# EasyEDA schematic SCH_Final-2_2024-12-22.json
TITLE: SKEMATIK ARDUINO UNO R3; REV: 1.0; Date: 2024-10-28; Sheet: 1/1; Drawn By: FAJAR RICHARDO; Company: UNIVERSITAS PADJADJARAN
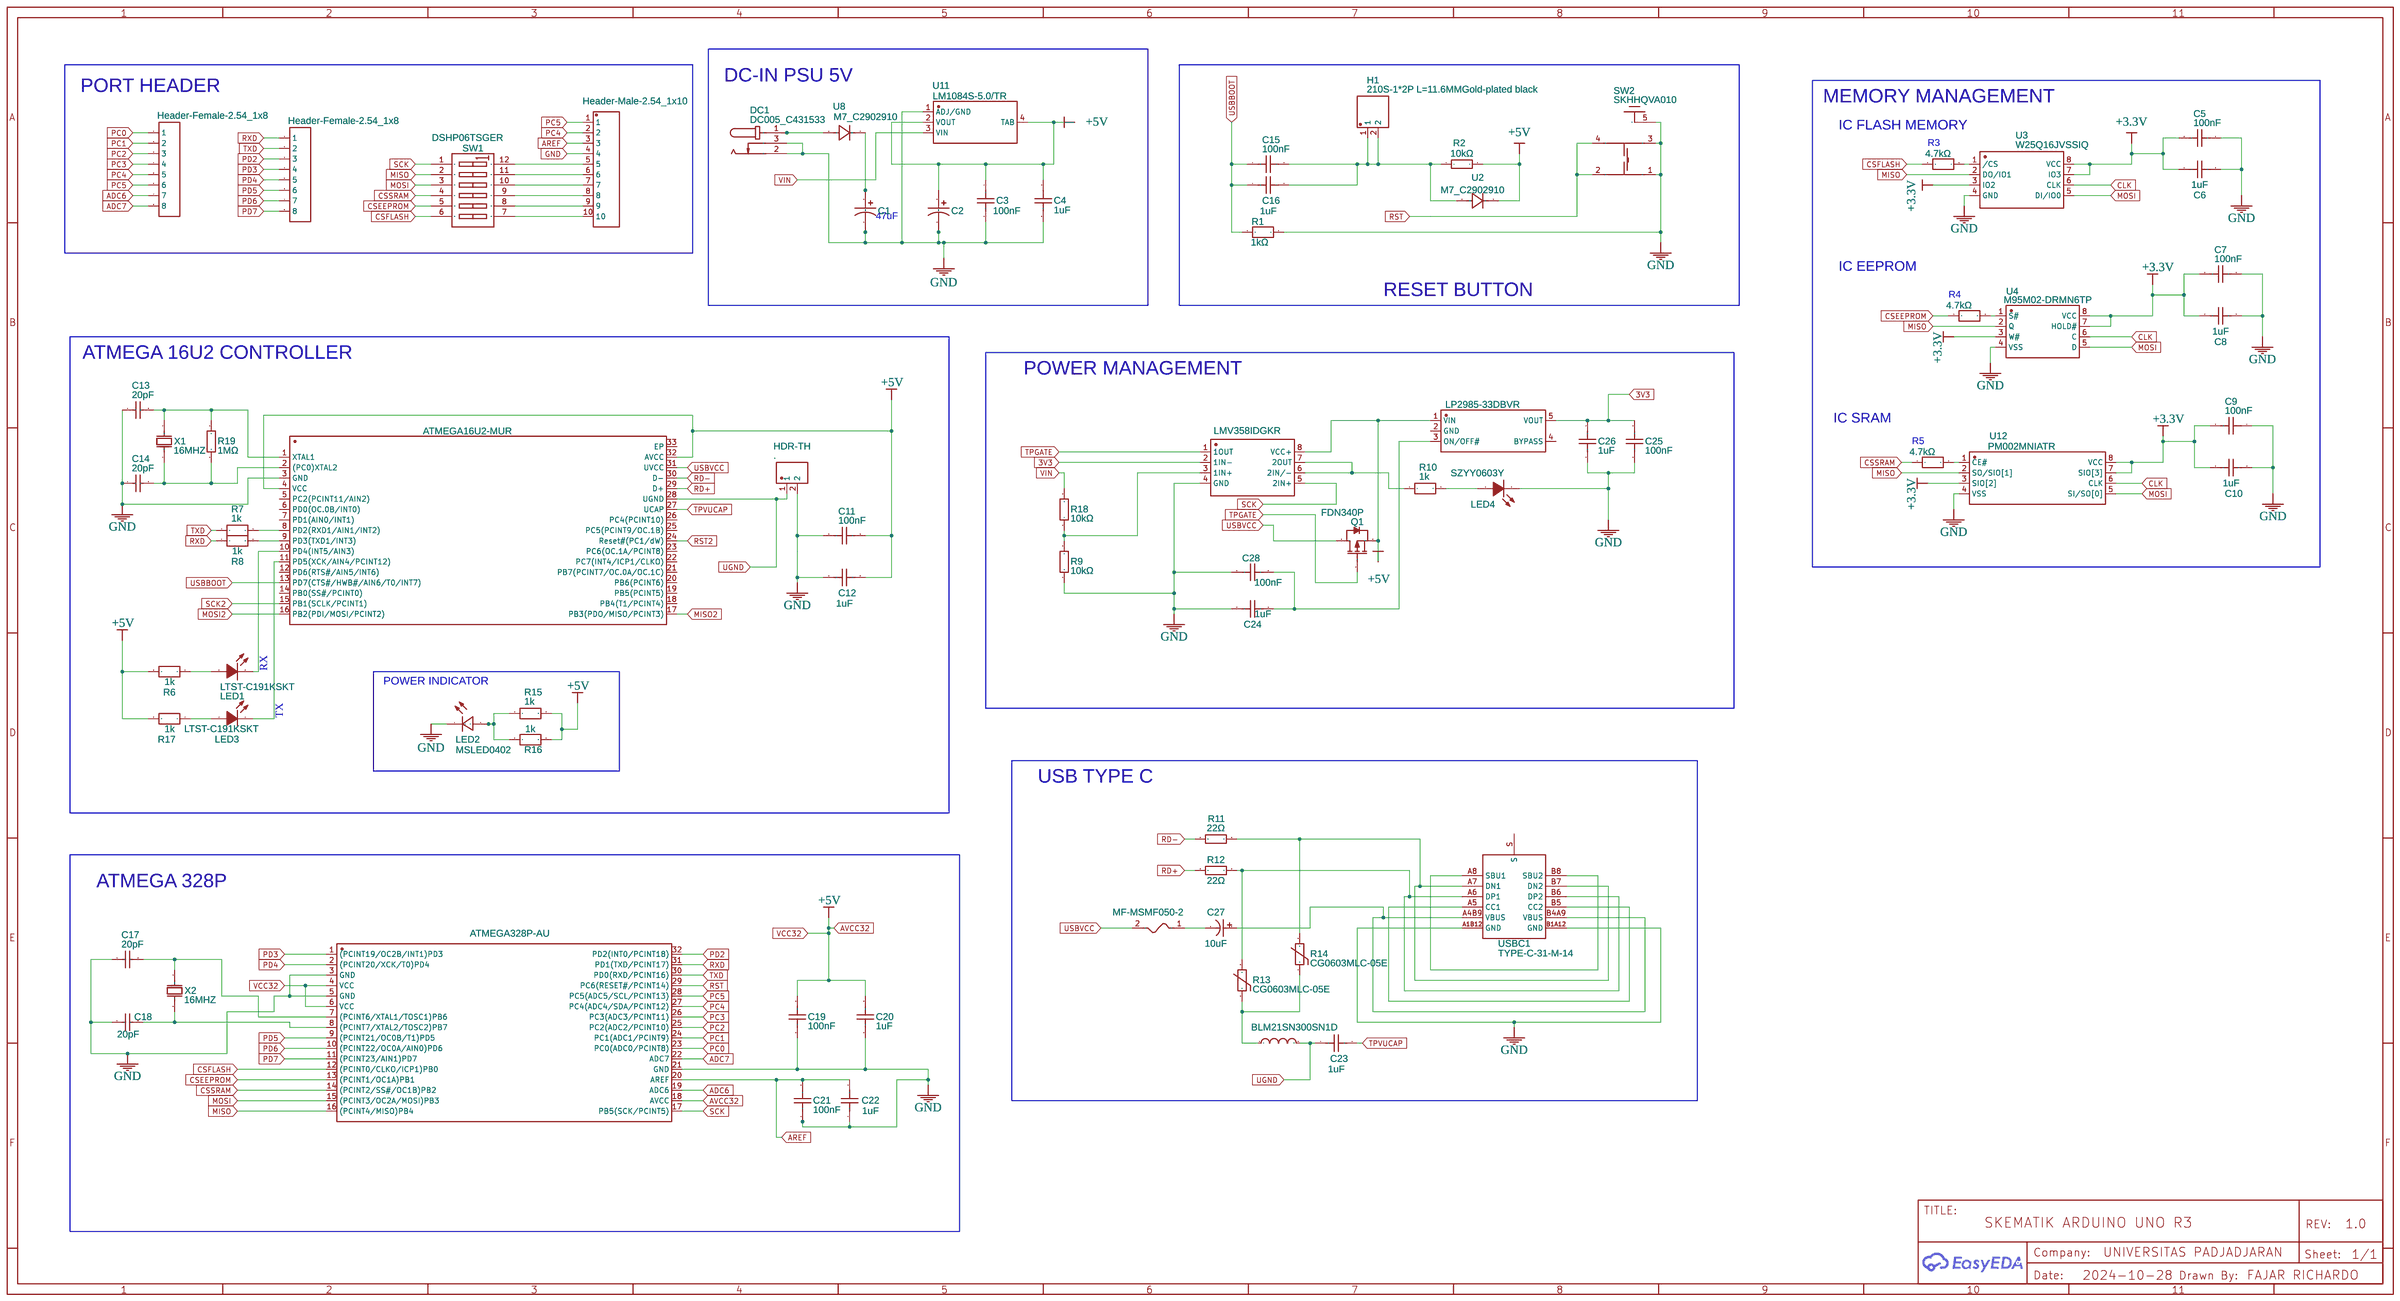
[diagram p0: schematic sheet]

## Parts
C1  47uF  [CAP-SMD_BD6.3-L6.6-W6.6-LS7.2-FD]
C2  47uF  [CAP-SMD_BD6.3-L6.6-W6.6-LS7.2-FD]
C3  100nF  [C0402]
C4  1uF  [C0402]
C5  100nF  [C01005]
C6  1uF  [CAP-TH_L17.0-W8.5-P15.00-D1.2-FD]
C7  100nF  [C01005]
C8  1uF  [CAP-TH_L17.0-W8.5-P15.00-D1.2-FD]
C9  100nF  [C01005]
C10  1uF  [CAP-TH_L17.0-W8.5-P15.00-D1.2-FD]
C11  100nF  [C0402]
C12  1uF  [C0402]
C13  20pF  [C0603]
C14  20pF  [C0603]
C15  100nF  [C0402]
C16  1uF  [C0402]
C17  20pF  [C0603]
C18  20pF  [C0603]
C19  100nF  [C0402]
C20  1uF  [C0402]
C21  100nF  [C0402]
C22  1uF  [C0402]
C23  1uF  [C0402]
C24  1uF  [C0402]
C25  100nF  [C0402]
C26  1uF  [C0402]
C27  10uF  [CAP-TH_BD4.0-P1.50-D0.8-FD]
C28  100nF  [C0402]
DC1  DC005_C431533  [DC-IN-TH_DC005]
H1  210S-1*2P L=11.6MMGold-plated black  [HDR-TH_2P-P2.54-V-M-1]
HDR-TH  .  [HDR-TH_2P-P2.54-V-M-1]
LED1  LTST-C191KSKT  [LED0603-RD-YELLOW]
LED2  MSLED0402  [LED0402-RD_GREEN]
LED3  LTST-C191KSKT  [LED0603-RD-YELLOW]
LED4  SZYY0603Y  [LED0603-R-RD-YELLOW]
PBX  Header-Male-2.54_1x10  [HDR-TH_10P-P2.54-V-M-1]
PCX  Header-Female-2.54_1x8  [HDR-TH_8P-P2.54-V-F-1]
PDX  Header-Female-2.54_1x8  [HDR-TH_8P-P2.54-V-F-1]
Q1  FDN340P  [SOT-23-3_L2.9-W1.6-P1.90-LS2.8-BR]
R1  1kΩ  [R0402]
R2  10kΩ  [R0603]
R6  1k  [R0402]
R7  1k  [R0402]
R8  1k  [R0402]
R9  10kΩ  [R0603]
R10  1k  [R0402]
R11  22Ω  [R0805]
R12  22Ω  [R0805]
R13  CG0603MLC-05E  [R0603]
R14  CG0603MLC-05E  [R0603]
R15  1k  [R0402]
R16  1k  [R0402]
R17  1k  [R0402]
R18  10kΩ  [R0603]
R19  1MΩ  [R0603]
SW1  DSHP06TSGER  [SW-SMD_12P-L9.3-W5.4-P1.27-LS8.4]
SW2  SKHHQVA010  [SW-TH_5P-L6.0-W6.0-P4.50-LS6.5]
U1  ATMEGA16U2-MUR  [QFN-32_L5.0-W5.0-P0.50-TL-EP3.7]
U2  M7_C2902910  [SMA_L4.5-W2.7-LS5.1-RD]
U3  W25Q16JVSSIQ  [SOIC-8_L5.3-W5.3-P1.27-LS8.0-BL]
U4  M95M02-DRMN6TP  [SOP-8_L4.9-W3.9-P1.27-LS6.0-BL]
U5  ATMEGA328P-AU  [TQFP-32_L7.0-W7.0-P0.80-LS9.0-BL]
U6  BLM21SN300SN1D  [L0805]
U7  MF-MSMF050-2  [F1812]
U8  M7_C2902910  [SMA_L4.5-W2.7-LS5.1-RD]
U9  LP2985-33DBVR  [SOT-23-5_L2.9-W1.6-P0.95-LS2.8-TL]
U10  LMV358IDGKR  [VSSOP-8_L3.0-W3.0-P0.65-LS5.0-BL]
U11  LM1084S-5.0/TR  [TO-263-3_L8.6-W10.2-P2.54-LS14.4-TL]
U12  PM002MNIATR  [SOP-8_L4.9-W3.9-P1.27-LS6.0-BL]
U17  4.7kΩ  [R0805]
U18  4.7kΩ  [R0805]
U19  4.7kΩ  [R0805]
USBC1  TYPE-C-31-M-14  [USB-C-SMD_12P-P0.50-H-F_TYPE-C-31-M-14]
X1  16MHZ  [OSC-SMD_L5.0-W3.2]
X2  16MHZ  [OSC-SMD_L5.0-W3.2]

## Library data of the parts
C1 C2 = 16SEV47M6.3X5.5: Contributor: lcsc; Supplier: LCSC; Supplier Part: C3829703; Manufacturer: rubycon(红宝石)
C3 C4 C11 C12 C15 C16 C19-C26 C28 = C_0402_US: Contributor: LCEDA_Lib
C5 C7 C9 = CL02A104KQ2NNNC: Contributor: LCSC; Supplier: LCSC; Supplier Part: C318792; Manufacturer: SAMSUNG(三星)
C6 C8 C10 = 1uf/250V/CBBCapacitor: Supplier Part: C29321; Supplier: LCSC; Manufacturer: ReliaPro; JLCPCB Part Class: Extended Part
C13 C14 C17 C18 = GRM1885C1H200JA01D: Supplier: LCSC; Manufacturer: muRata(村田); Supplier Part: C77030; JLCPCB Part Class: Extended Part
C27 = electrolytic capacitor10UF50V: Supplier: LCSC; Manufacturer: CX(承兴); Manufacturer Part: KS106M050C07RR0VH2FP0; Supplier Part: C32856; JLCPCB Part Class: Extended Part
DC1 = DC005_C431533: Contributor: LCSC; Supplier: LCSC; Supplier Part: C431533; Manufacturer: SHOU HAN(首韩); Manufacturer Part: DC005; JLCPCB Part Class: Extended Part
H1 = 210S-1*2P L=11.6MMGold-plated black: Contributor: LCSC; Supplier: LCSC; Manufacturer: Ckmtw(灿科盟); Manufacturer Part: B-2100S02P-A110; Supplier Part: C124375; JLCPCB Part Class: Extended Part
HDR-TH = 22-28-4020: Supplier: LCSC; Supplier Part: C234182; Manufacturer: MOLEX; Contributor: Nicolas Lo Vuolo; JLCPCB Part Class: Extended Part
LED1 LED3 = LTST-C191KSKT: Contributor: LCSC; Supplier: LCSC; Manufacturer: LITEON(光宝); Supplier Part: C125100; JLCPCB Part Class: Extended Part
LED2 = MSLED0402: Contributor: lcsc; Supplier: LCSC; Supplier Part: C9900013127; Manufacturer: null; JLCPCB Part Class: Extended Part
LED4 = SZYY0603Y: Contributor: LCSC; Supplier: LCSC; Supplier Part: C434424; Manufacturer: yongyu(永裕光电); JLCPCB Part Class: Extended Part
PBX = Header-Male-2.54_1x10: Supplier: LCSC; Manufacturer Part: 2.54-1*10P针; Supplier Part: C57369; JLCPCB Part Class: Extended Part; Manufacturer: BOOMELE(博穆精密)
PCX PDX = Header-Female-2.54_1x8: Supplier: LCSC; Manufacturer: BOOMELE(博穆精密); Manufacturer Part: 2.54-1*8P母环保; Supplier Part: C27438; JLCPCB Part Class: Extended Part
Q1 = FDN340P: Supplier: LCSC; Manufacturer: onsemi(安森美); Supplier Part: C75469; JLCPCB Part Class: Extended Part
R1 R6-R8 R10 R15-R17 = R_0402_EU: Contributor: LCEDA_Lib
R2 R9 R18 = RC0603FR-0710KL: Supplier: LCSC; Manufacturer: YAGEO(国巨); Supplier Part: C98220; JLCPCB Part Class: Extended Part
R11 R12 = RC0805FR-0722RL: JLCPCB Part Class: Extended Part; Supplier: LCSC; Manufacturer: YAGEO(国巨); Supplier Part: C107702; link: https://lcsc.com/eda_search?q=C107702&%26type=1&ref=editor; Contributor: Sameera Wanasinghe
R13 R14 = CG0603MLC-05E: Contributor: LCSC; Supplier: LCSC; Supplier Part: C840634; Manufacturer: BOURNS; JLCPCB Part Class: Extended Part
R19 = RC0603FR-071ML: Supplier: LCSC; Manufacturer: YAGEO(国巨); Supplier Part: C105578; JLCPCB Part Class: Extended Part
SW1 = DSHP06TSGER: Supplier: LCSC; Manufacturer: YE; Manufacturer Part: DSHP06TSGET; Supplier Part: C40737; JLCPCB Part Class: Extended Part
SW2 = SKHHQVA010: Contributor: LCSC; Supplier: LCSC; Supplier Part: C470256; Manufacturer: ALPSALPINE(阿尔卑斯阿尔派); JLCPCB Part Class: Extended Part
U1 = ATMEGA16U2-MUR: Contributor: LCSC; Supplier: LCSC; Supplier Part: C507117; Manufacturer: MICROCHIP(美国微芯); JLCPCB Part Class: Extended Part
U2 U8 = M7_C2902910: Supplier: LCSC; Supplier Part: C2902910; Manufacturer: MSKSEMI(美森科); Manufacturer Part: M7; JLCPCB Part Class: Extended Part; Contributor: lcsc
U3 = W25Q16JVSSIQ: Supplier: LCSC; Manufacturer: WINBOND(华邦); Supplier Part: C82317; JLCPCB Part Class: Extended Part
U4 = M95M02-DRMN6TP: Contributor: LCSC; Supplier: LCSC; Supplier Part: C915963; Manufacturer: ST(意法半导体); JLCPCB Part Class: Extended Part
U5 = ATMEGA328P-AU: Supplier: LCSC; Manufacturer: MICROCHIP(美国微芯); Supplier Part: C14877; JLCPCB Part Class: Extended Part
U6 = BLM21SN300SN1D: Contributor: LCSC; Supplier: LCSC; Supplier Part: C596496; Manufacturer: muRata(村田); JLCPCB Part Class: Extended Part
U7 = MF-MSMF050-2: Supplier: LCSC; Manufacturer: BOURNS; Supplier Part: C17313; JLCPCB Part Class: Extended Part
U9 = LP2985-33DBVR: Supplier: LCSC; Manufacturer: TI(德州仪器); Supplier Part: C95414; JLCPCB Part Class: Extended Part
U10 = LMV358IDGKR: Supplier: LCSC; Manufacturer: TI(德州仪器); Supplier Part: C105242; JLCPCB Part Class: Extended Part
U11 = LM1084S-5.0/TR: Contributor: LCSC; Supplier: LCSC; Supplier Part: C259973; Manufacturer: HGSEMI(华冠); JLCPCB Part Class: Extended Part
U12 = PM002MNIATR: Contributor: lcsc; Supplier: LCSC; Supplier Part: C7434471; Manufacturer: Siproin(上海矽朋); JLCPCB Part Class: Extended Part
U17-U19 = 0805 ±1% 4K7: Supplier: LCSC; Supplier Part: C2889438; Manufacturer: VO(翔胜); JLCPCB Part Class: Extended Part; Contributor: lcsc
USBC1 = TYPE-C-31-M-14: Contributor: LCSC; Supplier: LCSC; Supplier Part: C223907; Manufacturer: 韩国韩荣; JLCPCB Part Class: Extended Part
X1 X2 = X503216MSD2GC: Supplier Part: C49231; Supplier: LCSC; Manufacturer: YXC; JLCPCB Part Class: Extended Part

## Nets
3V3: C25.1 C26.1 U9.5(VOUT) U10.2(1IN-)
+3.3V: C5.2 C6.1 C7.2 C8.1 C9.2 C10.1 U3.3(IO2) U3.7(IO3) U3.8(VCC) U4.3(W#) U4.7(HOLD#) U4.8(VCC) U12.3(SIO[2]) U12.7(SIO[3]) U12.8(VCC)
+5V: C2.1 C3.1 C4.1 C11.2 C12.2 C19.2 C20.2 Q1.2(S) R2.2 R6.2 R15.2 R16.2 R17.2 U1.4(VCC) U1.32(AVCC) U2.1(Cathode) U5.4(VCC) U5.6(VCC) U5.18(AVCC) U9.1(VIN) U10.8(VCC+) U11.2(VOUT) U11.4(TAB)
GND: C1.2 C2.2 C3.2 C4.2 C5.1 C6.2 C7.1 C8.2 C9.1 C10.2 C11.1 C12.1 C13.1 C14.1 C17.1 C18.1 C19.1 C20.1 C21.1 C22.1 C24.1 C25.2 C26.2 C28.1 DC1.2 DC1.3 HDR-TH.2 LED2.1(C) LED4.2(-) PBX.4 R1.1 R9.1 SW2.1 SW2.3 SW2.5 U1.3(GND) U3.4(GND) U4.4(VSS) U5.3(GND) U5.5(GND) U5.21(GND) U10.4(GND) U11.1(ADJ/GND) U12.4(VSS) USBC1.A1B12(GND) USBC1.B1A12(GND)
VIN: R18.2 U11.3(VIN)
ADC6: PDX.7 U5.19(ADC6)
ADC7: PDX.8 U5.22(ADC7)
AREF: C21.2 C22.2 PBX.3 U5.20(AREF)
CLK: U3.6(CLK) U4.6(C) U12.6(CLK)
CSEEPROM: SW1.5(A5) U5.13((PCINT1/OC1A)PB1) U18.1
CSFLASH: SW1.6(A6) U5.12((PCINT0/CLKO/ICP1)PB0) U17.1
CSSRAM: SW1.4(A4) U5.14((PCINT2/SS#/OC1B)PB2) U19.1
MISO: SW1.2(A2) U3.2(DO/IO1) U4.2(Q) U5.16((PCINT4/MISO)PB4) U12.2(SO/SIO[1])
MISO2: U1.17(PB3(PDO/MISO/PCINT3))
MOSI: SW1.3(A3) U3.5(DI/IO0) U4.5(D) U5.15((PCINT3/OC2A/MOSI)PB3) U12.5(SI/SO[0])
MOSI2: U1.16(PB2(PDI/MOSI/PCINT2))
PC0: PDX.1 U5.23(PC0(ADC0/PCINT8))
PC1: PDX.2 U5.24(PC1(ADC1/PCINT9))
PC2: PDX.3 U5.25(PC2(ADC2/PCINT10))
PC3: PDX.4 U5.26(PC3(ADC3/PCINT11))
PC4: PBX.2 PDX.5 U5.27(PC4(ADC4/SDA/PCINT12))
PC5: PBX.1 PDX.6 U5.28(PC5(ADC5/SCL/PCINT13))
PD2: PCX.3 U5.32(PD2(INT0/PCINT18))
PD3: PCX.4 U5.1((PCINT19/OC2B/INT1)PD3)
PD4: PCX.5 U5.2((PCINT20/XCK/T0)PD4)
PD5: PCX.6 U5.9((PCINT21/OC0B/T1)PD5)
PD6: PCX.7 U5.10((PCINT22/OC0A/AIN0)PD6)
PD7: PCX.8 U5.11((PCINT23/AIN1)PD7)
RD+: R12.2 U1.29(D+)
RD-: R11.2 U1.30(D-)
RST: SW2.2 SW2.4 U5.29(PC6(RESET#/PCINT14))
RST2: U1.24(Reset#(PC1/dW))
RXD: PCX.1 R8.1 U5.31(PD1(TXD/PCINT17))
SCK: SW1.1(A1) U5.17(PB5(SCK/PCINT5)) U10.5(2IN+)
SCK2: U1.15(PB1(SCLK/PCINT1))
TPGATE: Q1.1(G) U10.1(1OUT)
TPVUCAP: C23.2 U1.27(UCAP)
TXD: PCX.2 R7.1 U5.30(PD0(RXD/PCINT16))
UGND: C23.1 HDR-TH.1 U1.28(UGND) U6.2
USBBOOT: C15.1 C16.1 R1.2 U1.13(PD7(CTS#/HWB#/AIN6/T0/INT7))
USBVCC: Q1.3(D) U1.31(UVCC) U7.2
Net-(C1-1): C1.1 U8.1(Cathode)
Net-(C13-2): C13.2 R19.1 U1.1(XTAL1) X1.1(OSC1)
Net-(C14-2): C14.2 R19.2 U1.2((PC0)XTAL2) X1.2(OSC2)
Net-(C15-2): C15.2 C16.2 H1.1 H1.2 R2.1 U2.2(Anode)
Net-(C17-2): C17.2 U5.7((PCINT6/XTAL1/TOSC1)PB6) X2.1(OSC1)
Net-(C18-2): C18.2 U5.8((PCINT7/XTAL2/TOSC2)PB7) X2.2(OSC2)
Net-(C24-2): C24.2 C28.2 U9.3(ON/OFF#)
Net-(C27-1): C27.1(+) USBC1.A4B9(VBUS) USBC1.B4A9(VBUS)
Net-(C27-2): C27.2(-) U7.1
Net-(DC1-1): DC1.1 U8.2(Anode)
Net-(LED1-1): LED1.1(-) U1.10(PD4(INT5/AIN3))
Net-(LED1-2): LED1.2(+) R6.1
Net-(LED2-2): LED2.2(A) R15.1 R16.1
Net-(LED3-1): LED3.1(-) U1.11(PD5(XCK/AIN4/PCINT12))
Net-(LED3-2): LED3.2(+) R17.1
Net-(LED4-1): LED4.1(+) R10.2
Net-(PBX-5): PBX.5 SW1.12(B1)
Net-(PBX-6): PBX.6 SW1.11(B2)
Net-(PBX-7): PBX.7 SW1.10(B3)
Net-(PBX-8): PBX.8 SW1.9(B4)
Net-(PBX-9): PBX.9 SW1.8(B5)
Net-(PBX-10): PBX.10 SW1.7(B6)
Net-(R7-2): R7.2 U1.8(PD2(RXD1/AIN1/INT2))
Net-(R8-2): R8.2 U1.9(PD3(TXD1/INT3))
Net-(R9-2): R9.2 R18.1 U10.3(1IN+)
Net-(R10-1): R10.1 U10.6(2IN/-) U10.7(2OUT)
Net-(R11-1): R11.1 R14.2 USBC1.A7(DN1) USBC1.B7(DN2)
Net-(R12-1): R12.1 R13.2 USBC1.A6(DP1) USBC1.B6(DP2)
Net-(R13-1): R13.1 R14.1 U6.1
Net-(U3-1): U3.1(/CS) U17.2
Net-(U4-1): U4.1(S#) U18.2
Net-(U12-1): U12.1(CE#) U19.2
Net-(USBC1-A5): USBC1.A5(CC1) USBC1.B5(CC2)
Net-(USBC1-A8): USBC1.A8(SBU1) USBC1.B8(SBU2)

Not connected (* = marked no-connect by the designer): U1 5(PC2(PCINT11/AIN2)) 6(PD0(OC.0B/INT0)) 7(PD1(AIN0/INT1)) 12(PD6(RTS#/AIN5/INT6)) 14(PB0(SS#/PCINT0)) 18(PB4(T1/PCINT4)) 19(PB5(PCINT5)) 20(PB6(PCINT6)) 21(PB7(PCINT7/OC.0A/OC.1C)) 22(PC7(INT4/ICP1/CLKO)) 23(PC6(OC.1A/PCINT8)) 25(PC5(PCINT9/OC.1B)) 26(PC4(PCINT10)) 33(EP); U9 2(GND) 4(BYPASS); USBC1 S

## Notes on the sheet
- DC-IN PSU 5V
- PORT HEADER
- MEMORY MANAGEMENT
- IC FLASH MEMORY
- R3
- 47uF
- IC EEPROM
- RESET BUTTON
- R4
- ATMEGA 16U2 CONTROLLER
- POWER MANAGEMENT
- IC SRAM
- R5
- RX
- POWER INDICATOR
- TX
- USB TYPE C
- ATMEGA 328P
